# EAGLE schematic EngineersThumb (EAGLE 9.6.2)
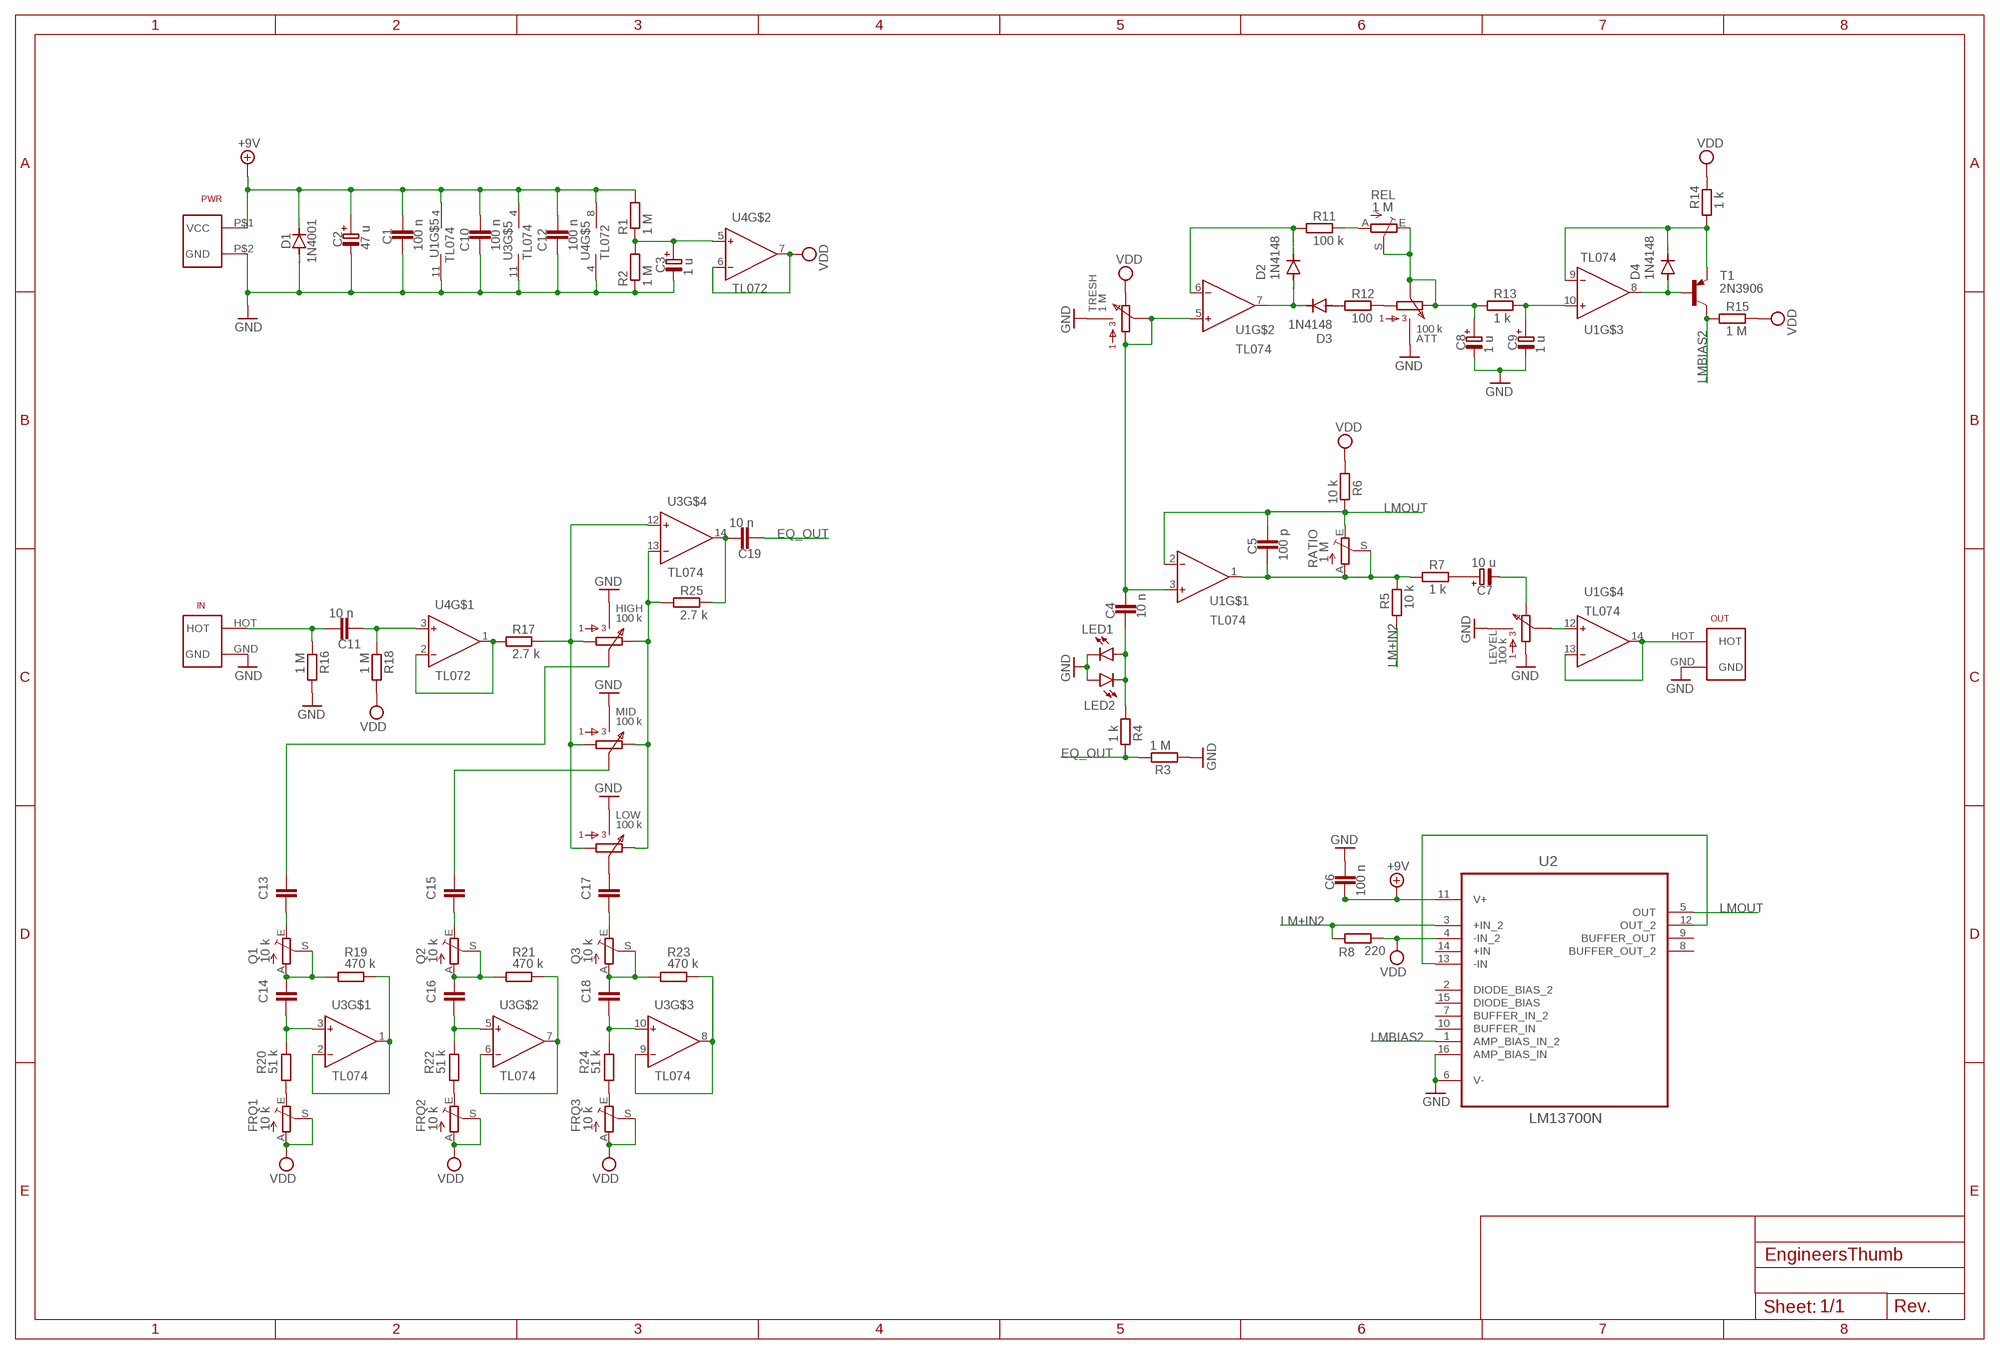
[diagram p0: schematic, sheet 1]

## Parts
ATT  100 k  RK09L1140  [RK09L1140]
C1  100 n  C-EU025-025X050  [C025-025X050]
C2  47 u  C-PR-2,0X5  [E2,0-5]
C3  1 u  C-PR-2,0X5  [E2,0-5]
C4  10 n  C-EU025-025X050  [C025-025X050]
C5  100 p  C-EU025-025X050  [C025-025X050]
C6  100 n  C-EU025-025X050  [C025-025X050]
C7  10 u  C-PR-2,0X5  [E2,0-5]
C8  1 u  C-PR-2,0X5  [E2,0-5]
C9  1 u  C-PR-2,0X5  [E2,0-5]
C10  100 n  C-EU025-025X050  [C025-025X050]
C11  10 n  C-EU025-025X050  [C025-025X050]
C12  100 n  C-EU025-025X050  [C025-025X050]
C13  C-EU025-025X050  [C025-025X050]
C14  C-EU025-025X050  [C025-025X050]
C15  C-EU025-025X050  [C025-025X050]
C16  C-EU025-025X050  [C025-025X050]
C17  C-EU025-025X050  [C025-025X050]
C18  C-EU025-025X050  [C025-025X050]
C19  10 n  C-EU025-025X050  [C025-025X050]
D1  1N4001  1N4004  [DO41-10]
D2  1N4148  1N4148DO35-10  [DO35-10]
D3  1N4148  1N4148DO35-10  [DO35-10]
D4  1N4148  1N4148DO35-10  [DO35-10]
FRQ1  10 k  TRIM_EU-B64Y  [B64Y]
FRQ2  10 k  TRIM_EU-B64Y  [B64Y]
FRQ3  10 k  TRIM_EU-B64Y  [B64Y]
HIGH  100 k  RK09L1140  [RK09L1140]
IN  UNBALANCED_INPUT_JACK  [BALANCED_INPUT_JACK]
LED1  TLLG4400  [LED3MM]
LED2  TLLG4400  [LED3MM]
LEVEL  100 k  RK09L1140  [RK09L1140]
LOW  100 k  RK09L1140  [RK09L1140]
MID  100 k  RK09L1140  [RK09L1140]
OUT  UNBALANCED_INPUT_JACK  [BALANCED_INPUT_JACK]
PWR  PWR  [PWR]
Q1  10 k  TRIM_EU-B64Y  [B64Y]
Q2  10 k  TRIM_EU-B64Y  [B64Y]
Q3  10 k  TRIM_EU-B64Y  [B64Y]
R1  1 M  R-EU_0204/7  [0204/7]
R2  1 M  R-EU_0204/7  [0204/7]
R3  1 M  R-EU_0204/7  [0204/7]
R4  1 k  R-EU_0204/7  [0204/7]
R5  10 k  R-EU_0204/7  [0204/7]
R6  10 k  R-EU_0204/7  [0204/7]
R7  1 k  R-EU_0204/7  [0204/7]
R8  220  R-EU_0204/7  [0204/7]
R11  100 k  R-EU_0204/7  [0204/7]
R12  100  R-EU_0204/7  [0204/7]
R13  1 k  R-EU_0204/7  [0204/7]
R14  1 k  R-EU_0204/7  [0204/7]
R15  1 M  R-EU_0204/7  [0204/7]
R16  1 M  R-EU_0204/7  [0204/7]
R17  2.7 k  R-EU_0204/7  [0204/7]
R18  1 M  R-EU_0204/7  [0204/7]
R19  470 k  R-EU_0204/7  [0204/7]
R20  51 k  R-EU_0204/7  [0204/7]
R21  470 k  R-EU_0204/7  [0204/7]
R22  51 k  R-EU_0204/7  [0204/7]
R23  470 k  R-EU_0204/7  [0204/7]
R24  51 k  R-EU_0204/7  [0204/7]
R25  2.7 k  R-EU_0204/7  [0204/7]
RATIO  1 M  TRIM_EU-B64Y  [B64Y]
REL  1 M  TRIM_EU-B64Y  [B64Y]
T1  2N3906  [TO92]
TRESH  1 M  RK09L1140  [RK09L1140]
U1  TL074  TL074IDTPDIP-14  [DIP762W53P254L1969H508Q14B]
U2  LM13700N  [DIP254P762X508-16]
U3  TL074  TL074IDTPDIP-14  [DIP762W53P254L1969H508Q14B]
U4  TL072  TL072PDIP-8  [DIP762W53P254L980H508Q8B]

## Nets
+9V: C1.1 C2.+ C6.2 C10.1 C12.1 D1.C PWR.P$1(VCC) R1.2 U1.4(V+) U2.11(V+) U3.4(V+) U4.8(V+)
EQ_OUT: C19.2 R3.2 R4.2
EQ_OUT1: C11.1 IN.HOT R16.2
GND: ATT.P$4 ATT.P$5 C1.2 C2.- C3.- C6.1 C8.- C9.- C10.2 C12.2 D1.A HIGH.P$4 HIGH.P$5 IN.GND LED1.K(C) LED2.A LEVEL.P$1 LEVEL.P$4 LEVEL.P$5 LOW.P$4 LOW.P$5 MID.P$4 MID.P$5 OUT.GND PWR.P$2(GND) R2.1 R3.1 R16.1 TRESH.P$4 TRESH.P$5 U1.11(V-) U2.6(V-) U2.16(AMP_BIAS_IN) U3.11(V-) U4.4(V-)
LM+IN2: R5.1 R8.1 U2.3(+IN_2)
LMBIAS2: R15.1 T1.1(C) U2.1(AMP_BIAS_IN_2)
LMOUT: C5.1 R6.2 RATIO.E U1.2(IN-) U2.5(OUT)
N$1: C3.+ R1.1 R2.2 U4.5(IN+)
N$2: C4.2 LED1.A LED2.K(C) R4.1
N$3: C11.2 R18.2 U4.3(IN+)
N$4: C4.1 TRESH.P$1 TRESH.P$2 U1.3(IN+) U1.5(IN+)
N$5: U2.12(OUT_2) U2.13(-IN)
N$6: C7.+ R7.2
N$7: C5.2 R5.2 R7.1 RATIO.A RATIO.S U1.1(OUT)
N$8: C7.- LEVEL.P$3
N$9: D2.A D3.C U1.7(OUT)
N$10: D2.C R11.1 U1.6(IN-)
N$11: R11.2 REL.A
N$12: ATT.P$2 ATT.P$3 C8.+ R13.1 REL.E REL.S
N$13: D3.A R12.1
N$14: ATT.P$1 R12.2
N$15: C9.+ R13.2 U1.10(IN+)
N$16: D4.A T1.2(B) U1.8(OUT)
N$17: D4.C R14.1 T1.3(E) U1.9(IN-)
N$18: R17.1 U4.1(OUT) U4.2(IN-)
N$19: OUT.HOT U1.13(IN-) U1.14(OUT)
N$20: HIGH.P$1 LOW.P$1 MID.P$1 R17.2 U3.12(IN+)
N$21: HIGH.P$3 LOW.P$3 MID.P$3 R25.1 U3.13(IN-)
N$22: C13.1 Q1.E
N$23: C14.2 Q1.A Q1.S R19.1
N$24: R19.2 U3.1(OUT) U3.2(IN-)
N$25: C14.1 R20.2 U3.3(IN+)
N$26: C15.1 Q2.E
N$27: FRQ1.E R20.1
N$28: C16.2 Q2.A Q2.S R21.1
N$29: R21.2 U3.6(IN-) U3.7(OUT)
N$30: C16.1 R22.2 U3.5(IN+)
N$31: FRQ2.E R22.1
N$32: C17.1 Q3.E
N$33: C18.2 Q3.A Q3.S R23.1
N$34: R23.2 U3.8(OUT) U3.9(IN-)
N$35: C18.1 R24.2 U3.10(IN+)
N$36: FRQ3.E R24.1
N$37: C17.2 LOW.P$2
N$38: C13.2 HIGH.P$2
N$39: C15.2 MID.P$2
N$40: LEVEL.P$2 U1.12(IN+)
N$41: C19.1 R25.2 U3.14(OUT)
VDD: FRQ1.A FRQ1.S FRQ2.A FRQ2.S FRQ3.A FRQ3.S R6.1 R8.2 R14.2 R15.2 R18.1 TRESH.P$3 U2.4(-IN_2) U4.6(IN-) U4.7(OUT)
Unconnected: U2.2(DIODE_BIAS_2) U2.7(BUFFER_IN_2) U2.8(BUFFER_OUT_2) U2.9(BUFFER_OUT) U2.10(BUFFER_IN) U2.14(+IN) U2.15(DIODE_BIAS)

## Library data of the parts
ATT HIGH LEVEL LOW MID TRESH = passives:RK09L1140: RK09L1140 Potentiometer
C1 C4-C6 C10-C19 = passives:C-EU: CAPACITOR, European symbol; SPICEPREFIX: C
C2 C3 C7-C9 = passives:C-PR: POLARIZED ELECTROLYTIC/TANTALUM
D1 = passives:1N4004: DIODE general purpose rectifier, 1 A
D2-D4 = passives:1N4148: DIODE high speed (Philips)
FRQ1-FRQ3 Q1-Q3 RATIO REL = passives:TRIM_EU-: POTENTIOMETER
IN OUT = connectors:UNBALANCED_INPUT_JACK
LED1 LED2 = passives:TLLG4400: Low Current (2mA) LED 3 mm Tinted Diffused Package color GREEN Source: Data sheet <http://www.farnell.com/datasheets/391098.pdf>; MF: VISHAY SEMICONDUCTOR; OC_FARNELL: 1612435
PWR = connectors:PWR
R1-R8 R11-R25 = passives:R-EU_: RESISTOR, European symbol; SPICEPREFIX: R
T1 = passives:2N3906: PNP Transistor
U1 U3 = ic:TL074IDT: Low noise JFET quad operational amplifier; LINK: https://eu.mouser.com/ProductDetail/Texas-Instruments/TL074CN?qs=%2Fha2pyFadui04%2FQQ4Z%2F%252B8cpHvrlLCfjGhhp9sdrT5Zo%3D; MPN: TL074CN; SUPPLIER: Mouser
U2 = ic:LM13700N: Dual Operational Transconductance Amplifiers Check prices <https://pricing.snapeda.com/parts/LM13700N/NOPB/Texas%20Instruments/view-part?ref=eda>; LINK: https://eu.mouser.com/ProductDetail/Texas-Instruments/LM13700N-NOPB?qs=X1J7HmVL2ZFKw9D7azZDXw%3D%3D; MPN: LM13700N/NOPB; SUPPLIER: Mouser
U4 = ic:TL072: Low noise JFET quad operational amplifier; LINK: https://www.mouser.se/ProductDetail/Texas-Instruments/TL072IP?qs=5BZzbFV4k2v7IBrcArRPQw%3D%3D; MPN: TL072IP; SUPPLIER: Mouser